# Altium schematic sheet Control.SchDoc
size 406 x 304 mm; SheetNumber: 3; SheetTotal: 6
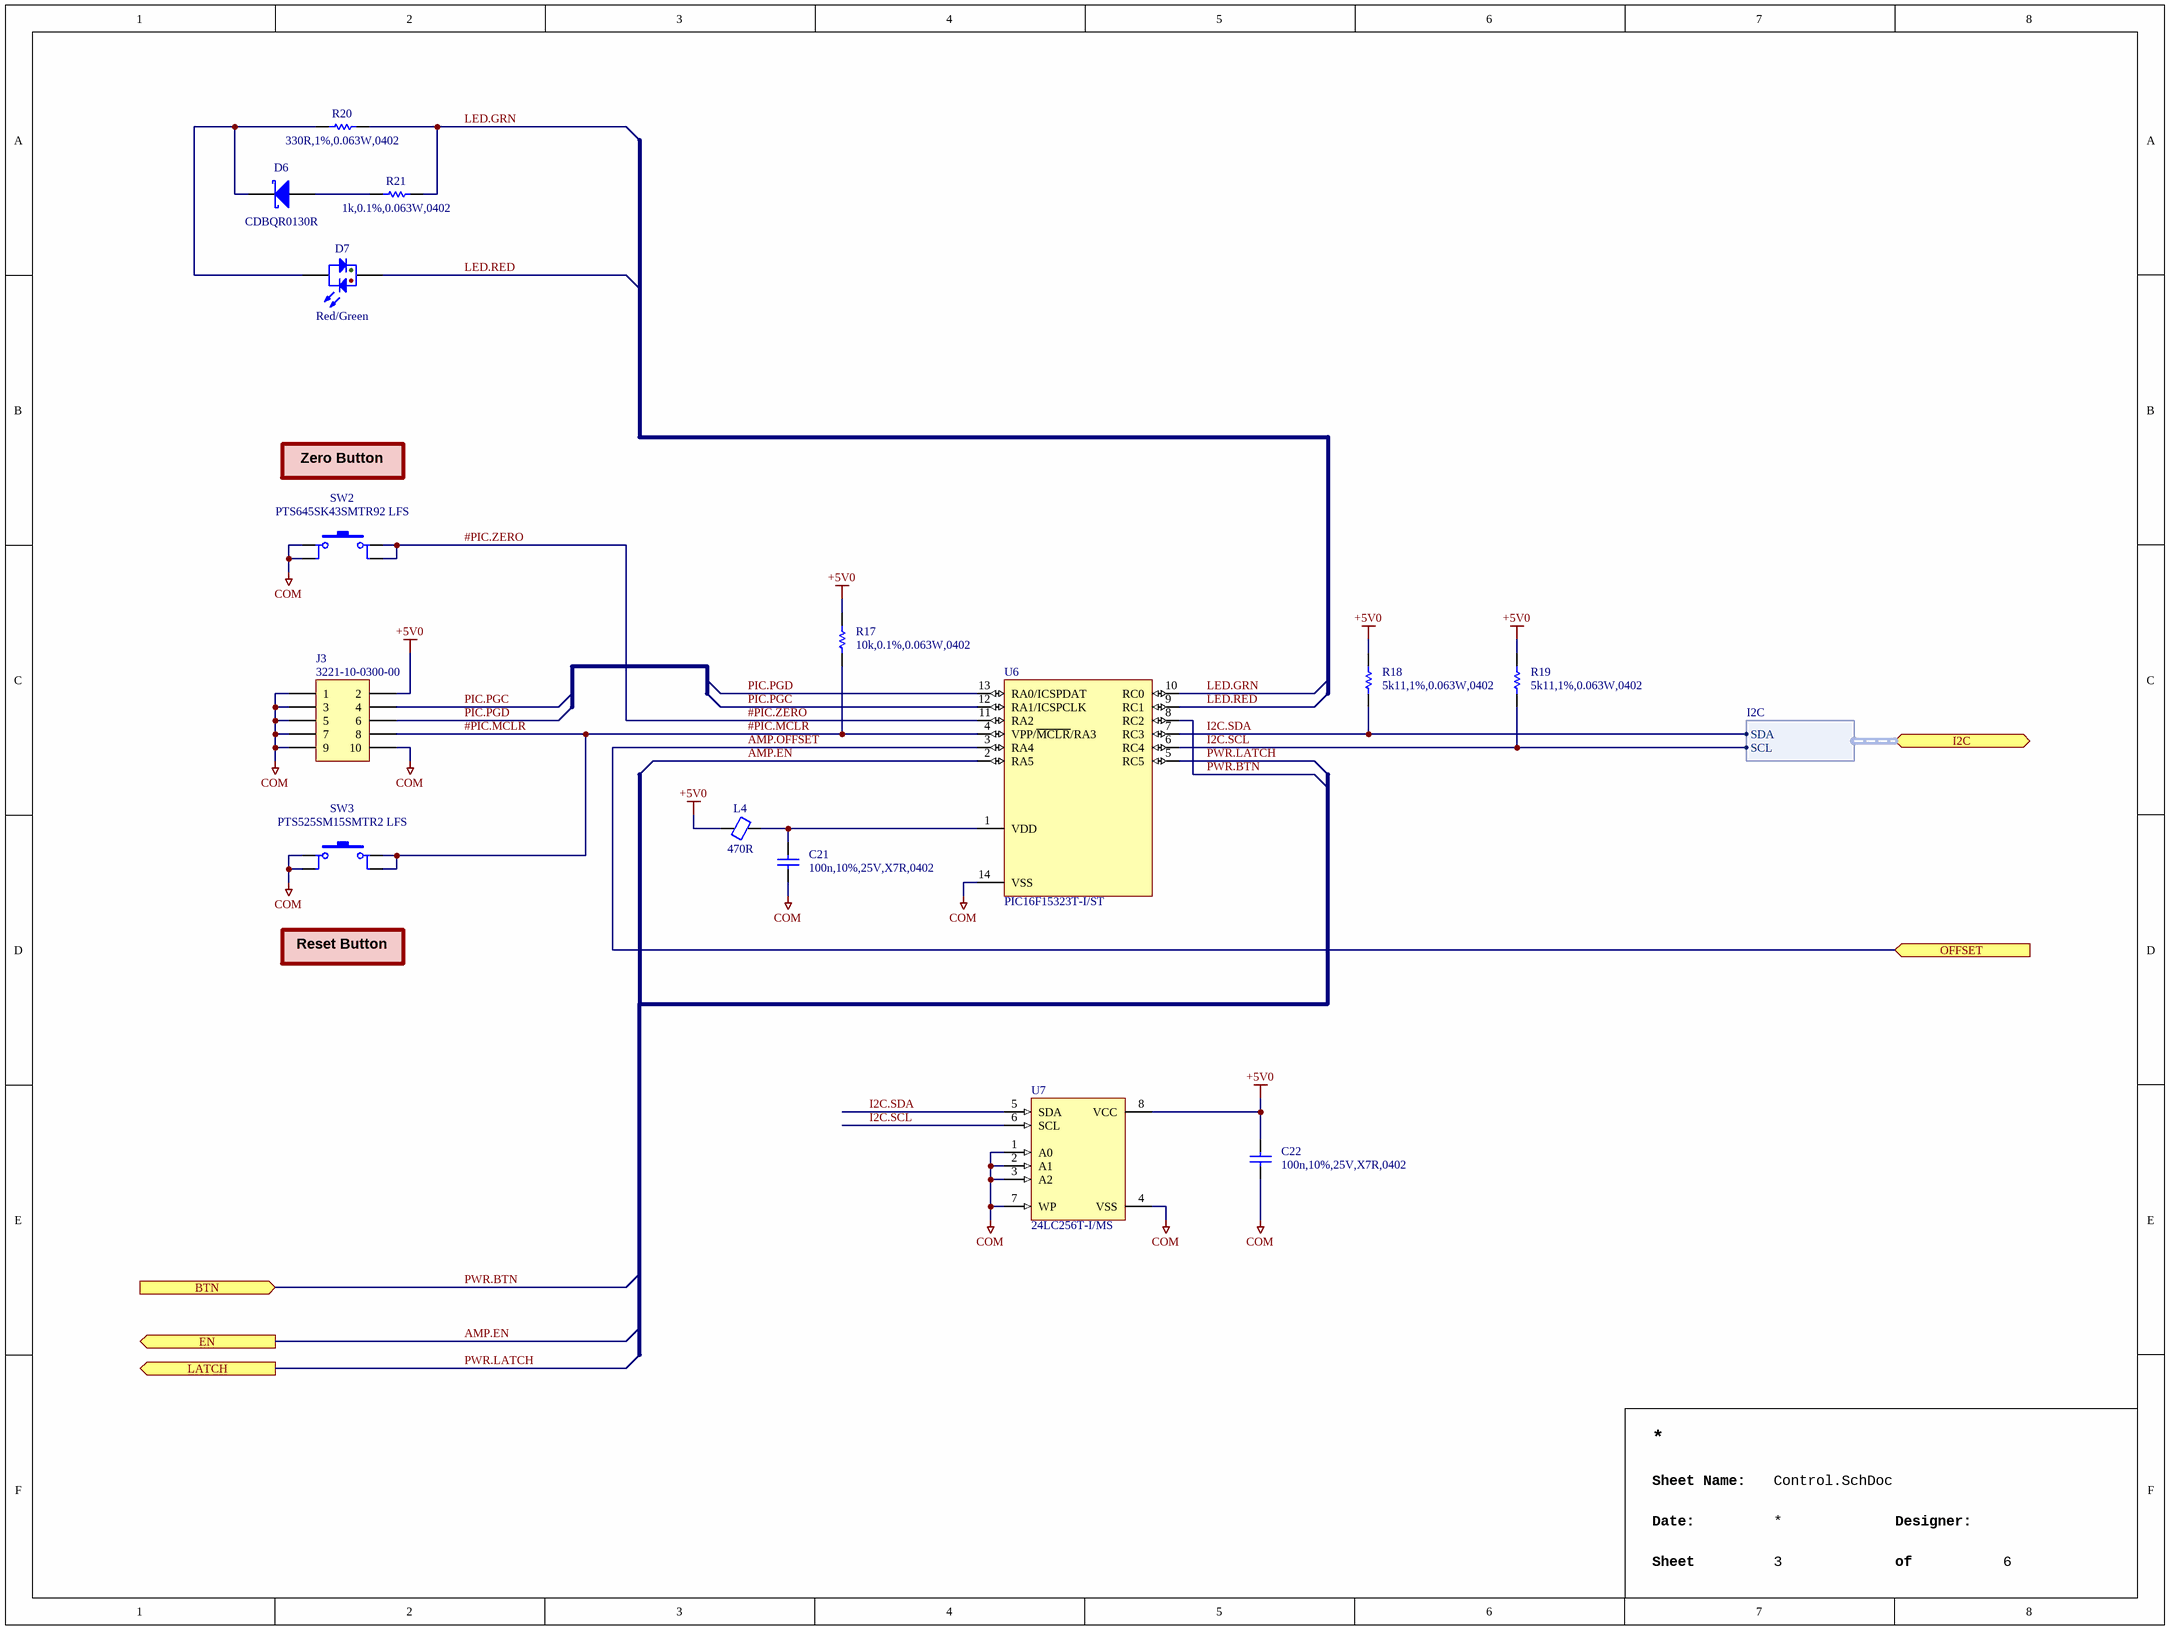
[diagram p0: Control.SchDoc]

## Parts
C21  100n,10%,25V,X7R,0402  [CAPC1005X06N]
C22  100n,10%,25V,X7R,0402  [CAPC1005X06N]
D6  CDBQR0130R  [DFN65P100X50-2N]
D7  Red/Green  [LED_XZMDKVG55W-4]
J3  3221-10-0300-00  [CNC Tech_3221-10-0300-00]
L4  470R  [INDC1005X05N]
R17  10k,0.1%,0.063W,0402  [RESC1005X04N]
R18  5k11,1%,0.063W,0402  [RESC1005X04N]
R19  5k11,1%,0.063W,0402  [RESC1005X04N]
R20  330R,1%,0.063W,0402  [RESC1005X04N]
R21  1k,0.1%,0.063W,0402  [RESC1005X04N]
SW2  PTS645SK43SMTR92 LFS  [C&K_PTS645SK43SMTR92 LFS]
SW3  PTS525SM15SMTR2 LFS  [C&K_PTS525SM15SMTR2 LFS]
U6  PIC16F15323T-I/ST  [MICROCHIP_PKG_TSSOP-14(C04-2087A)]
U7  24LC256T-I/MS  [MICROCHIP_PKG_MSOP8(C04-111-MS)]

## Ports
BTN (in), EN (out), I2C (bidir, harness I2C), LATCH (out), OFFSET (in)

## Harnesses
I2C: SCL, SDA

## Nets
+5V0: C22.2 J3.2 L4.1 R17.2 R18.2 R19.2 U7.8(VCC)
COM: C21.1 C22.1 J3.1 J3.3 J3.5 J3.7 J3.9 J3.10 SW2.1 SW2.2 SW3.1 SW3.2 U6.14(VSS) U7.1(A0) U7.2(A1) U7.3(A2) U7.4(VSS) U7.7(WP)
#PIC.MCLR: J3.8 R17.1 SW3.3 SW3.4 U6.4(VPP/~{MCLR}/RA3)
#PIC.ZERO: SW2.3 SW2.4 U6.11(RA2)
AMP.EN: U6.2(RA5) ; port EN
AMP.OFFSET: U6.3(RA4) ; port OFFSET
I2C.SCL: R19.1 U6.6(RC4) U7.6(SCL) ; port I2C.SCL
I2C.SDA: R18.1 U6.7(RC3) U7.5(SDA) ; port I2C.SDA
LED.GRN: R20.2 R21.2 U6.10(RC0)
LED.RED: D7.2(K) U6.9(RC1)
PIC.PGC: J3.4 U6.12(RA1/ICSPCLK)
PIC.PGD: J3.6 U6.13(RA0/ICSPDAT)
PWR.BTN: U6.8(RC2) ; port BTN
PWR.LATCH: U6.5(RC5) ; port LATCH
NetC21_2: C21.2 L4.2 U6.1(VDD)
NetD6_1: D6.1(K) D7.1(A) R20.1
NetD6_2: D6.2(A) R21.1

## Notes on the sheet
- Zero Button
- Reset Button
- Sheet Name:
- Date:
- Sheet
- Designer:
- of

## Library data of the parts
C21 C22 = CAP,Cer,100nF,10%,25V,X7R,0402: 0.1ï¿½F ï¿½10% 25V Ceramic Capacitor X7R 0402 (1005 Metric); Manufacturer 1: Murata Electronics; Manufacturer 1 Part Number: GRM155R71E104KE14J; Vendor 1 Part Number: 490-14603-1-ND; Vendor 1: DigiKey; Value: 100nF; Part Name: CAP,Cer,100nF,10%,25V,X7R,0402; CreatedBy: Judd Foster; HelpURL: https://search.murata.co.jp/Ceramy/image/img/A01X/G101/ENG/GRM155R71E104KE14-01.pdf
D6 = DIODE,Schottky,30V,100mA,SMD: Diode 30 V 100mA Surface Mount 0402C/SOD-923F; Manufacturer 1: Comchip Technology; Vendor 1 Part Number: 641-1272-1-ND; Vendor 1: Digikey; Part Name: DIODE,Schottky,30V,100mA,SMD; CreatedBy: Judd Foster; HelpURL: https://mm.digikey.com/Volume0/opasdata/d220001/medias/docus/3209/CDBQR0130R.pdf; Manufacturer 1 Part Number: CDBQR0130R
D7 = LED,Bi-Color,Red/Grn,SMD,1206: Green, Red 570nm Green, 630nm Red LED Indication - Discrete 2.1V Green, 1.95V Red 1206 (3216 Metric); Manufacturer 1: SunLED; Manufacturer 1 Part Number: XZMDKVG55W-4; Vendor 1 Part Number: 1497-1314-1-ND; Vendor 1: Digikey; Part Name: LED,Bi-Color,Red/Grn,SMD,1206; CreatedBy: Judd Foster; HelpURL: https://www.sunledusa.com/products/spec/XZMDKVG55W-4.pdf; Value: Red/Green
J3 = Term,Header,5x2 Pin,Shroud,1.27mm,SMD: Connector Header Surface Mount 10 position 0.050" (1.27mm); Manufacturer 1: CNC Tech; Vendor 1 Part Number: 1175-1735-ND; Vendor 1: Digikey; Part Name: Term,Header,5x2 Pin,Shroud,1.27mm,SMD; CreatedBy: Judd Foster; HelpURL: http://www.cnctech.us/pdfs/3221-XX-0300-00_.pdf; Manufacturer 1 Part Number: 3221-10-0300-00
L4 = Ferrite,470R@100MHz,0402: 470 Ohms @ 100 MHz 1 Power Line Ferrite Bead 0402 (1005 Metric) 1A 200mOhm; Manufacturer 1: Murata Electronics; Manufacturer 1 Part Number: BLM15PX471SN1D; Vendor 1 Part Number: 490-10662-1-ND; Vendor 1: Digikey; Part Name: Ferrite,470R@100MHz,0402; CreatedBy: Judd Foster; HelpURL: https://www.murata.com/en-us/products/productdata/8796740059166/ENFA0018.pdf; Value: 470R
R17 = RES,10k,0.1%,0.063W,0402: 10 kOhms ï¿½0.1% 0.1W, 1/10W Chip Resistor 0402 (1005 Metric) Automotive AEC-Q200 Thin Film; Manufacturer 1: Stackpole Electronics Inc; Manufacturer 1 Part Number: RNCF0402BTE10K0; Vendor 1 Part Number: RNCF0402BTE10K0CT-ND; Vendor 1: Digikey; Part Name: RES,10k,0.1%,0.063W,0402; CreatedBy: Judd Foster; HelpURL: https://www.seielect.com/catalog/sei-rncf.pdf; Value: 10k
R18 R19 = RES,5k11,1%,0.063W,0402: 5.11 kOhms ï¿½1% 0.063W, 1/16W Chip Resistor 0402 (1005 Metric) Automotive AEC-Q200, Moisture Resistant Thick Film; Manufacturer 1: Yageo; Manufacturer 1 Part Number: AC0402FR-075K11L; Vendor 1 Part Number: 13-AC0402FR-075K11LCT-ND; Vendor 1: Digikey; Part Name: RES,5k11,1%,0.063W,0402; CreatedBy: Judd Foster; HelpURL: https://www.yageo.com/upload/media/product/productsearch/datasheet/rchip/PYu-AC_51_RoHS_L_7.pdf; Value: 5k11
R20 = RES,330R,1%,0.063W,0402: 330 Ohms Â±1% 0.063W, 1/16W Chip Resistor 0402 (1005 Metric) Moisture Resistant Thick Film; Manufacturer 1: YAGEO; Manufacturer 1 Part Number: RC0402FR-07330RL; Vendor 1 Part Number: 311-330LRCT-ND; Vendor 1: DigiKey; Part Name: RES,330R,1%,0.063W,0402; CreatedBy: Judd Foster; HelpURL: https://www.yageo.com/upload/media/product/products/datasheet/rchip/PYu-RC_Group_51_RoHS_L_12.pdf; Value: 330R
R21 = RES,1k,0.1%,0.063W,0402: 1 kOhms Â±0.1% 0.063W, 1/16W Chip Resistor 0402 (1005 Metric) Thin Film; Manufacturer 1: YAGEO; Manufacturer 1 Part Number: RT0402BRE071KL; Vendor 1 Part Number: YAG2306CT-ND; Vendor 1: DigiKey; Part Name: RES,1k,0.1%,0.063W,0402; CreatedBy: Judd Foster; HelpURL: https://www.yageo.com/upload/media/product/app/datasheet/rchip/pyu-rt_1-to-0.01_rohs_l.pdf; Value: 1k
SW2 = Switch,Tactile,SPST-NO,SMD,H4.3: Tactile Switch SPST-NO Top Actuated Surface Mount; Manufacturer 1: C&K; Vendor 1 Part Number: CKN9084CT-ND; Vendor 1: Digikey; Part Name: Switch,Tactile,SPST-NO,SMD,H4.3; CreatedBy: Judd Foster; HelpURL: https://www.ckswitches.com/media/1471/pts645.pdf; Manufacturer 1 Part Number: PTS645SK43SMTR92 LFS
SW3 = Switch,Tactile,SPST-NO,SMD,H1.5: Tactile Switch SPST-NO Top Actuated Surface Mount; Manufacturer 1: C&K; Vendor 1 Part Number: CKN9104CT-ND; Vendor 1: Digikey; Part Name: Switch,Tactile,SPST-NO,SMD,H1.5; CreatedBy: Judd Foster; HelpURL: https://www.ckswitches.com/media/1467/pts525.pdf; Manufacturer 1 Part Number: PTS525SM15SMTR2 LFS
U6 = PIC16F15323T-I_ST: PIC PICÂ® XLPâ„¢ 16F Microcontroller IC 8-Bit 32MHz 3.5KB (2K x 14) FLASH 14-TSSOP; Manufacturer 1: Microchip Technology; Vendor 1 Part Number: PIC16F15323T-I/STCT-ND; Vendor 1: DigiKey; Part Name: PIC16F15323T-I_ST; CreatedBy: Judd Foster; HelpURL: https://ww1.microchip.com/downloads/en/DeviceDoc/PIC16_L_F15313_23_Data_Sheet_40001897C.pdf; Manufacturer 1 Part Number: PIC16F15323T-I/ST
U7 = 24LC256T-I_MS: EEPROM Memory IC 256Kbit I2C 400 kHz 900 ns 8-MSOP; Manufacturer 1: Microchip Technology; Vendor 1 Part Number: 24LC256T-I/MSCT-ND; Vendor 1: DigiKey; Part Name: 24LC256T-I_MS; CreatedBy: Judd Foster; HelpURL: https://ww1.microchip.com/downloads/aemDocuments/documents/MPD/ProductDocuments/DataSheets/24AA256-24LC256-24FC256-256K-I2C-Serial-EEPROM-DS20001203.pdf; Manufacturer 1 Part Number: 24LC256T-I/MS